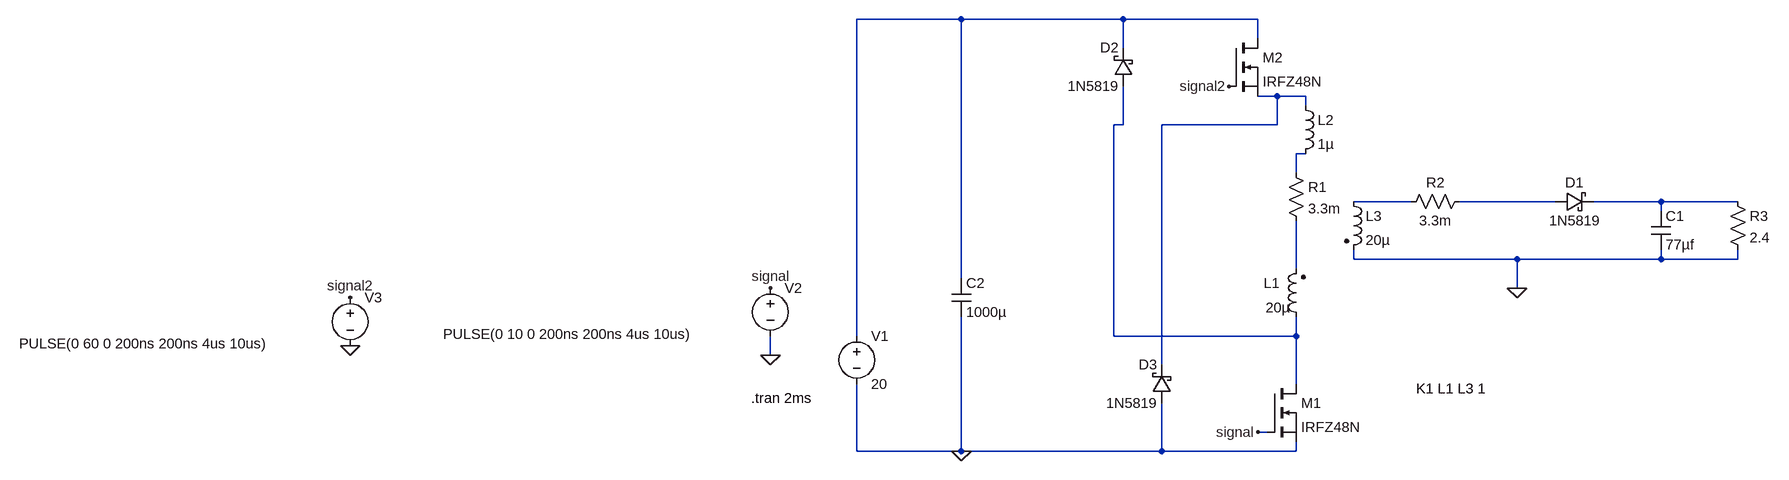
[diagram p0: schematic flyback_circuit_two_switch2.asc]
flyback_circuit_two_switch2.asc, the LTspice schematic file:
Version 4
SHEET 1 2204 680
WIRE 240 -304 64 -304
WIRE 1120 -304 240 -304
WIRE 1344 -304 1120 -304
WIRE 1344 -272 1344 -304
WIRE 1120 -256 1120 -304
WIRE 1376 -176 1344 -176
WIRE 1424 -176 1376 -176
WIRE 1424 -160 1424 -176
WIRE 1120 -128 1120 -192
WIRE 1120 -128 1104 -128
WIRE 1376 -128 1376 -176
WIRE 1376 -128 1184 -128
WIRE 1424 -80 1408 -80
WIRE 1408 -48 1408 -80
WIRE 1600 0 1504 0
WIRE 1840 0 1680 0
WIRE 2016 0 1904 0
WIRE 2144 0 2016 0
WIRE 2016 16 2016 0
WIRE 1504 96 1504 80
WIRE 1776 96 1504 96
WIRE 2016 96 2016 80
WIRE 2016 96 1776 96
WIRE 2144 96 2144 80
WIRE 2144 96 2016 96
WIRE 1408 112 1408 32
WIRE 240 128 240 -304
WIRE 1776 144 1776 96
WIRE 64 224 64 -304
WIRE 1104 224 1104 -128
WIRE 1408 224 1408 192
WIRE 1408 224 1104 224
WIRE -80 256 -80 224
WIRE 1184 272 1184 -128
WIRE 1408 304 1408 224
WIRE 1360 384 1344 384
WIRE 64 416 64 304
WIRE 240 416 240 192
WIRE 240 416 64 416
WIRE 1184 416 1184 336
WIRE 1184 416 240 416
WIRE 1408 416 1408 400
WIRE 1408 416 1184 416
FLAG 240 416 0
FLAG -80 256 0
FLAG -80 144 signal
FLAG 1344 384 signal
FLAG 1776 144 0
FLAG -832 240 0
FLAG -832 160 signal2
FLAG 1296 -192 signal2
SYMBOL voltage 64 208 R0
WINDOW 123 0 0 Left 0
WINDOW 39 0 0 Left 0
SYMATTR InstName V1
SYMATTR Value 20
SYMBOL nmos 1360 304 R0
SYMATTR InstName M1
SYMATTR Value IRFZ48N
SYMBOL ind2 1424 208 R180
WINDOW 0 43 72 Left 2
WINDOW 3 26 31 Left 2
SYMATTR InstName L1
SYMATTR Value 20µ
SYMATTR Type ind
SYMATTR SpiceLine2 IC=0
SYMBOL ind2 1488 -16 R0
SYMATTR InstName L3
SYMATTR Value 20µ
SYMATTR Type ind
SYMBOL voltage -80 128 R0
WINDOW 3 -565 93 Left 2
WINDOW 123 0 0 Left 0
WINDOW 39 0 0 Left 0
SYMATTR Value PULSE(0 10 0 200ns 200ns 4us 10us)
SYMATTR InstName V2
SYMBOL cap 2000 16 R0
SYMATTR InstName C1
SYMATTR Value 77µf
SYMATTR SpiceLine2 IC=12
SYMBOL res 2128 -16 R0
SYMATTR InstName R3
SYMATTR Value 2.4
SYMBOL nmos 1296 -272 R0
SYMATTR InstName M2
SYMATTR Value IRFZ48N
SYMBOL voltage -832 144 R0
WINDOW 3 -565 93 Left 2
WINDOW 123 0 0 Left 0
WINDOW 39 0 0 Left 0
SYMATTR Value PULSE(0 60 0 200ns 200ns 4us 10us)
SYMATTR InstName V3
SYMBOL schottky 1136 -192 R180
WINDOW 0 24 64 Left 2
WINDOW 3 24 0 Left 2
SYMATTR InstName D2
SYMATTR Value 1N5819
SYMATTR Description Diode
SYMATTR Type diode
SYMBOL cap 224 128 R0
SYMATTR InstName C2
SYMATTR Value 1000µ
SYMBOL schottky 1200 336 R180
WINDOW 0 24 64 Left 2
WINDOW 3 24 0 Left 2
SYMATTR InstName D3
SYMATTR Value 1N5819
SYMATTR Description Diode
SYMATTR Type diode
SYMBOL ind 1408 -176 R0
SYMATTR InstName L2
SYMATTR Value 1µ
SYMBOL res 1392 -64 R0
SYMATTR InstName R1
SYMATTR Value 3.3m
SYMBOL res 1696 -16 R90
WINDOW 0 0 56 VBottom 2
WINDOW 3 32 56 VTop 2
SYMATTR InstName R2
SYMATTR Value 3.3m
SYMBOL schottky 1840 16 R270
WINDOW 0 32 32 VTop 2
WINDOW 3 0 32 VBottom 2
SYMATTR InstName D1
SYMATTR Value 1N5819
SYMATTR Description Diode
SYMATTR Type diode
TEXT -112 328 Left 2 !.tran 2ms
TEXT 1608 312 Left 2 !K1 L1 L3 1

The netlist it stands for:
* flyback_circuit_two_switch2.asc
V1 N001 0 20
M1 N003 signal 0 0 IRFZ48N
L1 N003 N008 20µ IC=0
L3 N005 0 20µ
V2 signal 0 PULSE(0 10 0 200ns 200ns 4us 10us)
C1 N007 0 77µf IC=12
R3 N007 0 2.4
M2 N001 signal2 N002 N002 IRFZ48N
V3 signal2 0 PULSE(0 60 0 200ns 200ns 4us 10us)
D2 N003 N001 1N5819
C2 N001 0 1000µ
D3 0 N002 1N5819
L2 N002 N004 1µ
R1 N004 N008 3.3m
R2 N006 N005 3.3m
D1 N006 N007 1N5819
.model D D
.lib standard.dio
.model NMOS NMOS
.model PMOS PMOS
.lib standard.mos
.tran 2ms
K1 L1 L3 1
.backanno
.end